# Altium schematic sheet 2015-02-15_06-02-221.schdoc
size 441 x 172 mm; SheetNumber: 1; SheetTotal: 1
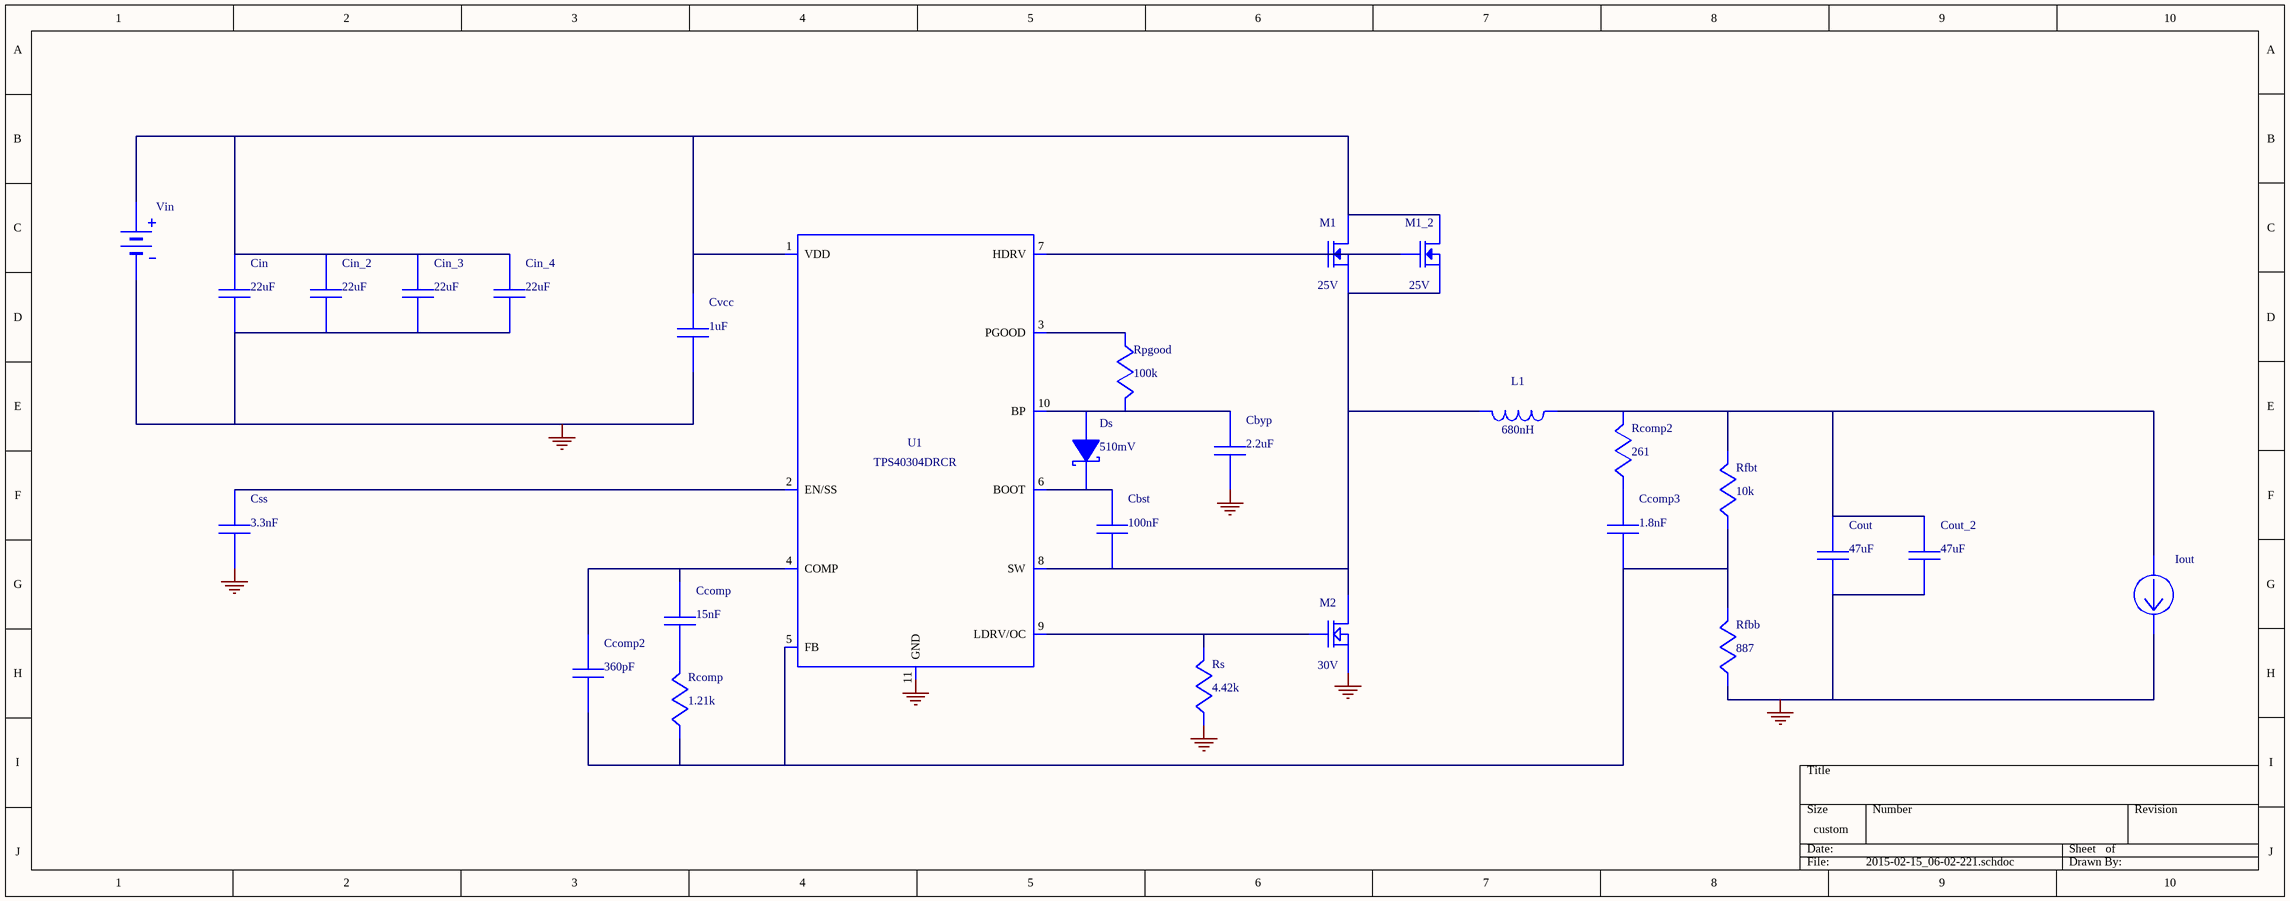
[diagram p0: 2015-02-15_06-02-221.schdoc]

## Parts
Cbst  value 100nF  (hidden comment: 08053C104KAT2A)
Cbyp  value 2.2uF  (hidden comment: GRM188R61A225KE34D)
Ccomp  value 15nF  (hidden comment: CC0805KRX7R9BB153)
Ccomp2  value 360pF  (hidden comment: GRM1555C1H361JA01D)
Ccomp3  value 1.8nF  (hidden comment: GRM155R71H182KA01D)
Cin  value 22uF  (hidden comment: GRM32ER61E226KE15L)
Cin_2  value 22uF  (hidden comment: GRM32ER61E226KE15L)
Cin_3  value 22uF  (hidden comment: GRM32ER61E226KE15L)
Cin_4  value 22uF  (hidden comment: GRM32ER61E226KE15L)
Cout  value 47uF  (hidden comment: C3216X6S1A476M)
Cout_2  value 47uF  (hidden comment: C3216X6S1A476M)
Css  value 3.3nF  (hidden comment: GRM033R71C332KA88D)
Cvcc  value 1uF  (hidden comment: GRM188R61E105KA12D)
Ds  value 510mV  (hidden comment: MBR0540T1G)
Iout  WB_CURRENT_LOAD  (value not drawn)
L1  value 680nH  (hidden comment: XAL1010-451MEB)
M1  value 25V  (hidden comment: CSD16340Q3)
M1_2  value 25V  (hidden comment: CSD16340Q3)
M2  value 30V  (hidden comment: BSZ050N03MS G)
Rcomp  value 1.21k  (hidden comment: CRCW04021K21FKED)
Rcomp2  value 261  (hidden comment: CRCW0402261RFKED)
Rfbb  value 887  (hidden comment: CRCW0402887RFKED)
Rfbt  value 10k  (hidden comment: CRCW040210K0FKED)
Rpgood  value 100k  (hidden comment: CRCW0402100KFKED)
Rs  value 4.42k  (hidden comment: CRCW04024K42FKED)
U1  TPS40304DRCR
Vin  WB_BATTERY  (value not drawn)

## Nets
0: Cbyp.2 Cin.2 Cin_2.2 Cin_3.2 Cin_4.2 Cout.2 Cout_2.2 Css.2 Cvcc.2 Iout.2(-) M2.1(Source) M2.2(Source) M2.3(Source) Rfbb.2 Rs.2 U1.11(GND) Vin.2(-)
NetCbst_1: Cbst.1 Ds.1(K) U1.6(BOOT)
NetCbst_2: Cbst.2 L1.1 M1.1(Source) M1.2(Source) M1.3(Source) M1_2.1(Source) M1_2.2(Source) M1_2.3(Source) M2.5(Drain) M2.6(Drain) M2.7(Drain) M2.8(Drain) M2.9(Drain) U1.8(SW)
NetCbyp_1: Cbyp.1 Ds.2(A) Rpgood.1 U1.10(BP)
NetCcomp2_1: Ccomp2.1 Ccomp3.2 Rcomp.2 Rfbb.1 Rfbt.2 U1.5(FB)
NetCcomp3_1: Ccomp3.1 Rcomp2.2
NetCcomp_1: Ccomp.1 Rcomp.1
NetCcomp_2: Ccomp.2 Ccomp2.2 U1.4(COMP)
NetCin_1: Cin.1 Cin_2.1 Cin_3.1 Cin_4.1 Cvcc.1 M1.5(Drain) M1.6(Drain) M1.7(Drain) M1.8(Drain) M1.9(Drain) M1_2.5(Drain) M1_2.6(Drain) M1_2.7(Drain) M1_2.8(Drain) M1_2.9(Drain) U1.1(VDD) Vin.1(+)
NetCout_1: Cout.1 Cout_2.1 Iout.1(+) L1.2 Rcomp2.1 Rfbt.1
NetCss_1: Css.1 U1.2(EN/SS)
NetM1_4: M1.4(Gate) M1_2.4(Gate) U1.7(HDRV)
NetM2_4: M2.4(Gate) Rs.1 U1.9(LDRV/OC)
NetRpgood_2: Rpgood.2 U1.3(PGOOD)

## Library data of the parts
Cbst = 08053C104KAT2A: Manufacturer Name: AVX; PackageReference: 08053C104KAT2A; Manufacturer Part Number: 08053C104KAT2A
Cbyp = GRM188R61A225KE34D: GRM188R61A225KE3; Manufacturer Name: MuRata; PackageReference: GRM188R61A225KE34D; Manufacturer Part Number: GRM188R61A225KE34D
Ccomp = CC0805KRX7R9BB153: CC0805KRX7R9BB15; Manufacturer Name: Yageo America; PackageReference: CC0805KRX7R9BB153; Manufacturer Part Number: CC0805KRX7R9BB153
Ccomp2 = GRM1555C1H361JA01D: GRM1555C1H361JA0; Manufacturer Name: MuRata; PackageReference: GRM1555C1H361JA01D; Manufacturer Part Number: GRM1555C1H361JA01D
Ccomp3 = GRM155R71H182KA01D: GRM155R71H182KA0; Manufacturer Name: MuRata; PackageReference: GRM155R71H182KA01D; Manufacturer Part Number: GRM155R71H182KA01D
Cin Cin_2-Cin_4 = GRM32ER61E226KE15L: GRM32ER61E226KE1; Manufacturer Name: MuRata; PackageReference: GRM32ER61E226KE15L; Manufacturer Part Number: GRM32ER61E226KE15L
Cout Cout_2 = C3216X6S1A476M: Manufacturer Name: TDK; PackageReference: C3216X6S1A476M; Manufacturer Part Number: C3216X6S1A476M
Css = GRM033R71C332KA88D: GRM033R71C332KA8; Manufacturer Name: MuRata; PackageReference: GRM033R71C332KA88D; Manufacturer Part Number: GRM033R71C332KA88D
Cvcc = GRM188R61E105KA12D: GRM188R61E105KA1; Manufacturer Name: MuRata; PackageReference: GRM188R61E105KA12D; Manufacturer Part Number: GRM188R61E105KA12D
Ds = MBR0540T1G: Manufacturer Name: ON Semiconductor; PackageReference: MBR0540T1G; Manufacturer Part Number: MBR0540T1G
Iout = WB_CURRENT_LOAD: Value: UNLISTED; PackageReference: WB_CURRENT_LOAD; Manufacturer Part Number: WB_CURRENT_LOAD; Manufacturer Name: WB_CURRENT_LOAD
L1 = XAL1010-451MEB: XAL1010-681MEB; Manufacturer Name: Coilcraft; PackageReference: XAL1010-681MEB; Manufacturer Part Number: XAL1010-451MEB
M1 M1_2 = CSD16340Q3: Manufacturer Name: Texas Instruments; PackageReference: CSD16340Q3; Manufacturer Part Number: CSD16340Q3
M2 = BSZ050N03MS G: Manufacturer Name: Infineon Technologies; PackageReference: BSZ050N03MS G; Manufacturer Part Number: BSZ050N03MS G
Rcomp = CRCW04021K21FKED: Manufacturer Name: Vishay-Dale; PackageReference: CRCW04021K21FKED; Manufacturer Part Number: CRCW04021K21FKED
Rcomp2 = CRCW0402261RFKED: Manufacturer Name: Vishay-Dale; PackageReference: CRCW0402261RFKED; Manufacturer Part Number: CRCW0402261RFKED
Rfbb = CRCW0402887RFKED: Manufacturer Name: Vishay-Dale; PackageReference: CRCW0402887RFKED; Manufacturer Part Number: CRCW0402887RFKED
Rfbt = CRCW040210K0FKED: Manufacturer Name: Vishay-Dale; PackageReference: CRCW040210K0FKED; Manufacturer Part Number: CRCW040210K0FKED
Rpgood = CRCW0402100KFKED: Manufacturer Name: Vishay-Dale; PackageReference: CRCW0402100KFKED; Manufacturer Part Number: CRCW0402100KFKED
Rs = CRCW04024K42FKED: Manufacturer Name: Vishay-Dale; PackageReference: CRCW04024K42FKED; Manufacturer Part Number: CRCW04024K42FKED
U1 = TPS40304DRCR: Manufacturer Name: Texas Instruments; Value: UNLISTED; PackageReference: TPS40304DRCR; Manufacturer Part Number: TPS40304DRCR
Vin = WB_BATTERY: Value: UNLISTED; PackageReference: WB_BATTERY; Manufacturer Part Number: WB_BATTERY; Manufacturer Name: WB_BATTERY